# EasyEDA schematic SCH_ocula-mux-bridge-1.1.json
TITLE: Sheet_1; REV: 1.1; Date: 2025-02-18; Sheet: 1/1; Drawn By: Sodiumlightbaby; Company: Your Company
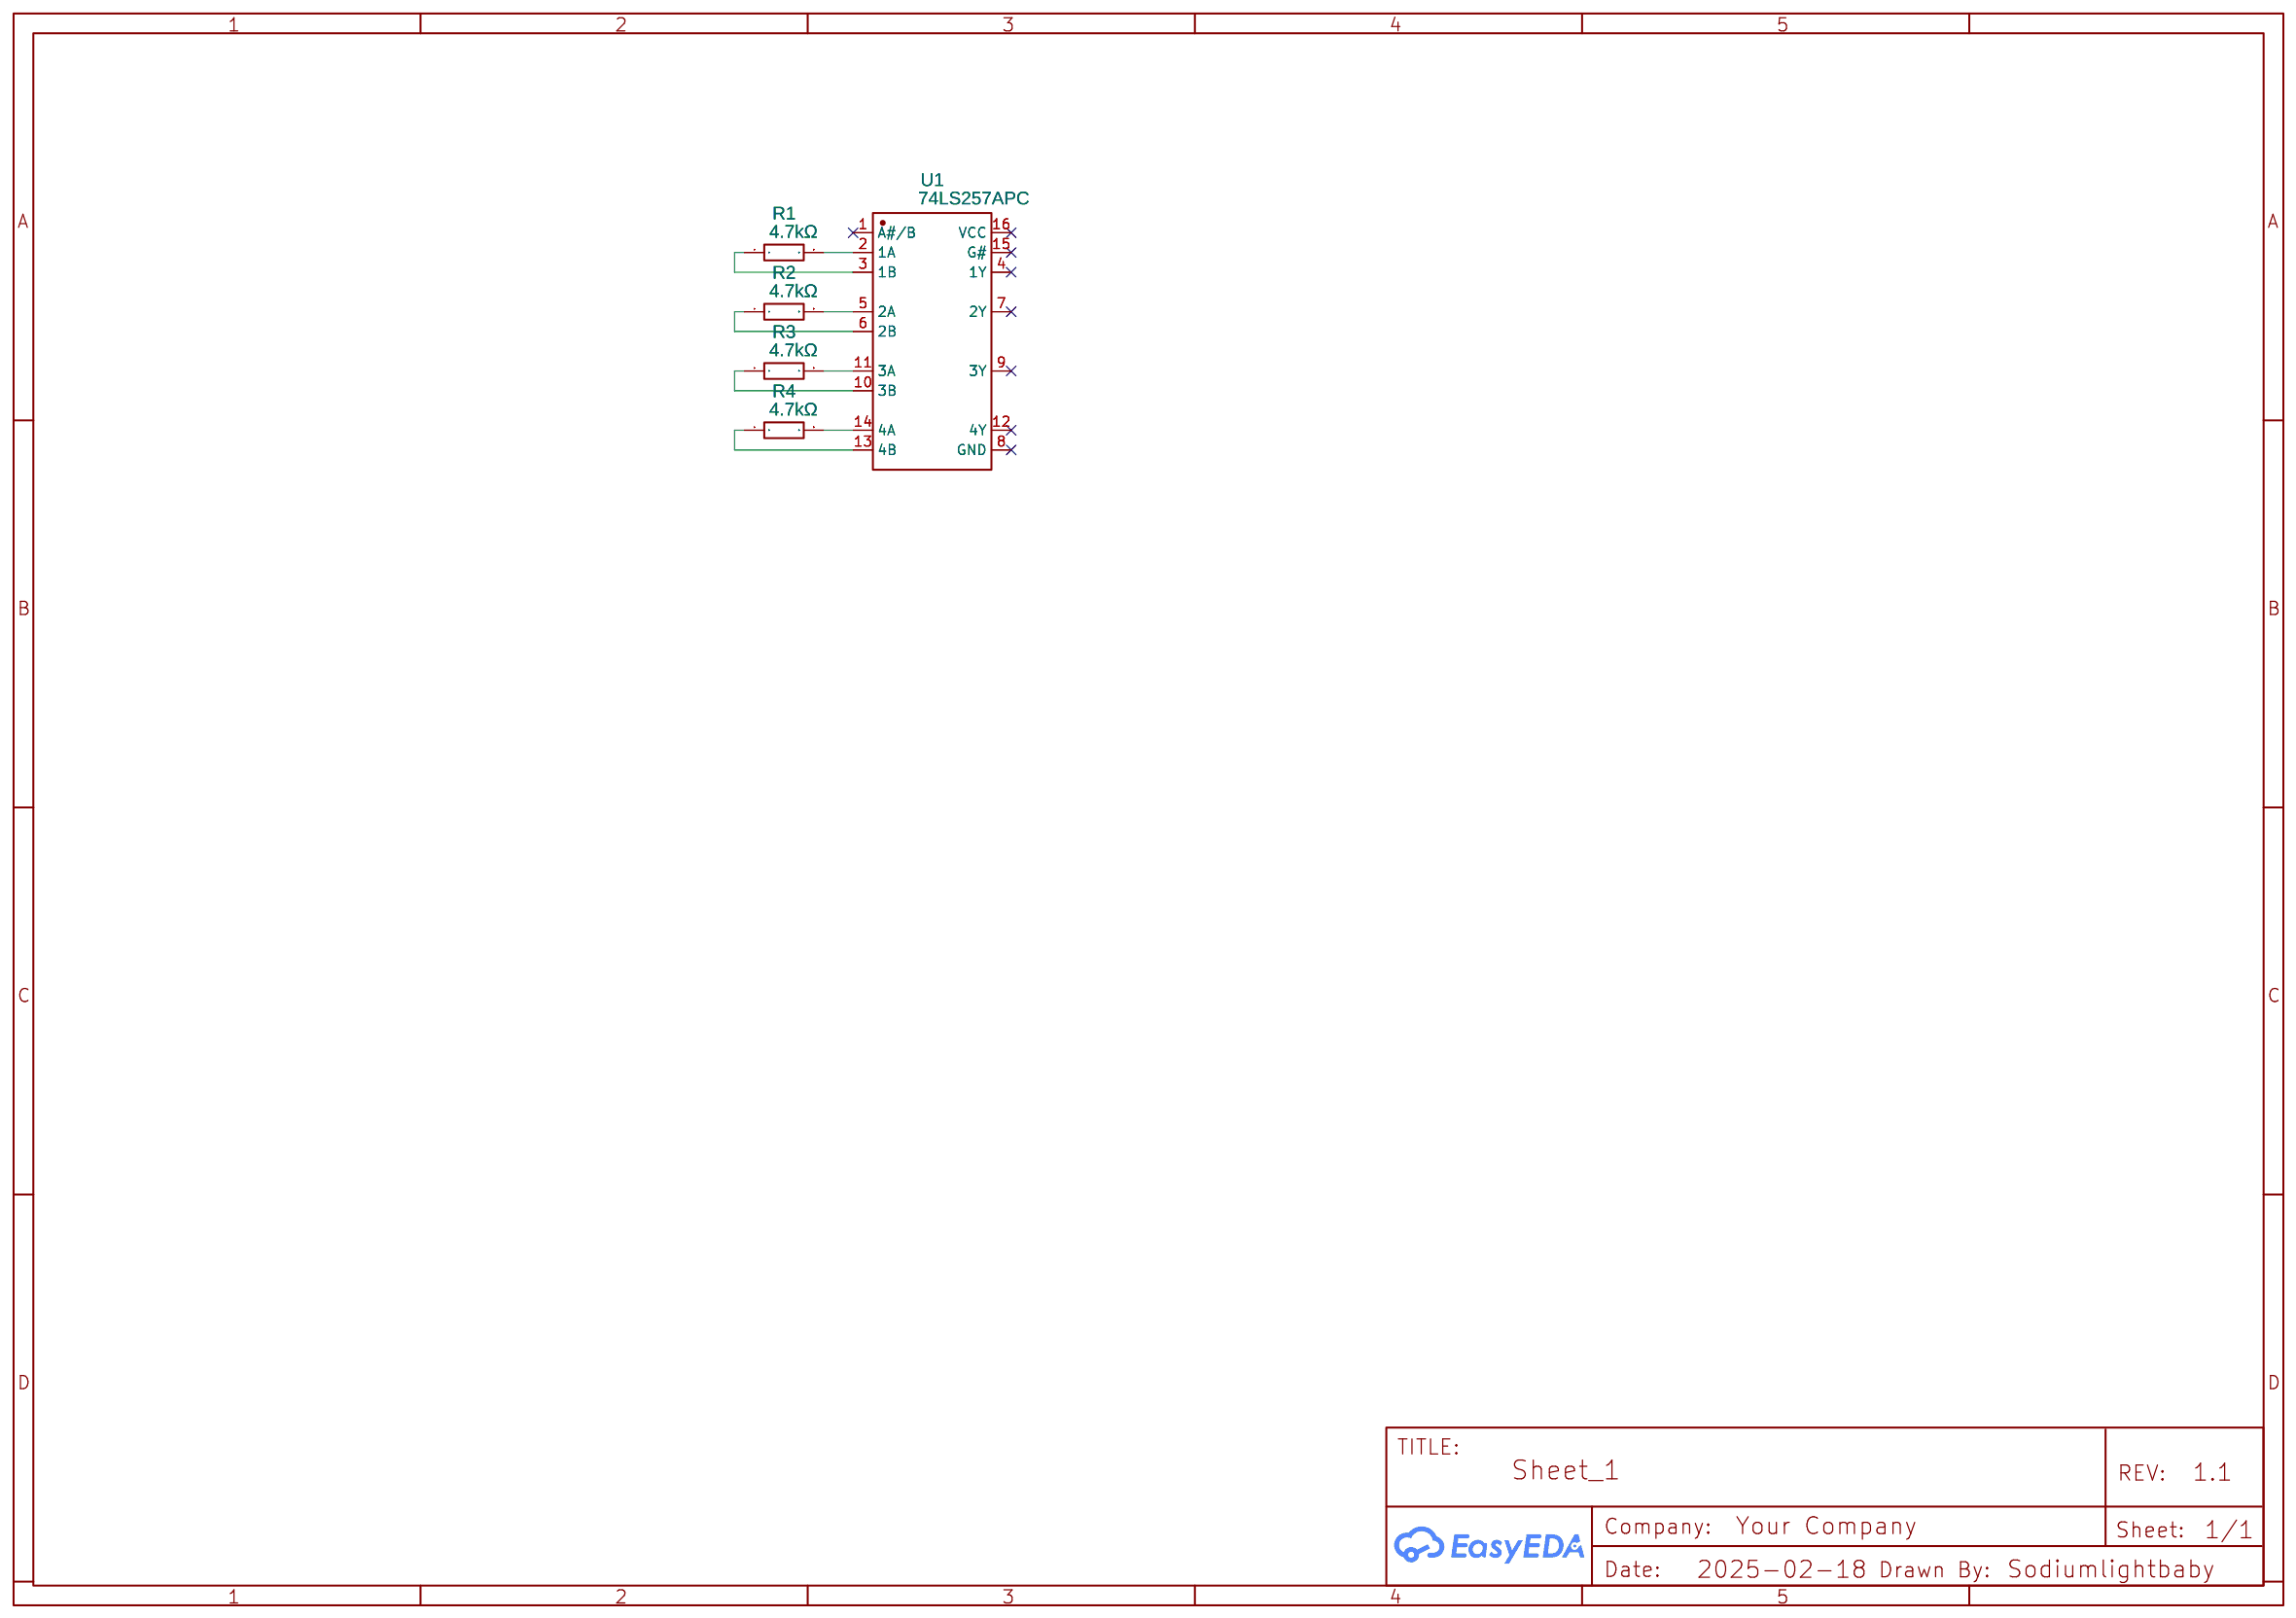
[diagram p0: schematic sheet]

## Parts
R1  4.7kΩ  [R0805]
R2  4.7kΩ  [R0805]
R3  4.7kΩ  [R0805]
R4  4.7kΩ  [R0805]
U1  74LS257APC  [PDIP-16_L19.3-W6.4-P2.54-LS7.94-BL]

## Library data of the parts
R1-R4 = 0805W8F4701T5E: Supplier: LCSC; Manufacturer: UNI-ROYAL(厚声); Supplier Part: C17673; JLCPCB Part Class: Basic Part
U1 = 74LS257APC: Contributor: lcsc; Supplier: LCSC; Supplier Part: C3207921; Manufacturer: TI(德州仪器)

## Nets
Net-(R1-1): R1.1 U1.3(1B)
Net-(R1-2): R1.2 U1.2(1A)
Net-(R2-1): R2.1 U1.6(2B)
Net-(R2-2): R2.2 U1.5(2A)
Net-(R3-1): R3.1 U1.10(3B)
Net-(R3-2): R3.2 U1.11(3A)
Net-(R4-1): R4.1 U1.13(4B)
Net-(R4-2): R4.2 U1.14(4A)

Not connected (* = marked no-connect by the designer): U1 1(A#/B)* 4(1Y)* 7(2Y)* 8(GND)* 9(3Y)* 12(4Y)* 15(G#)* 16(VCC)*
